# Altium schematic sheet opto.SchDoc: KART : FILTER
size A4; DrawnBy: JNieto; DocumentNumber: 4; Revision: 1.0; SheetNumber: 9; SheetTotal: 10; Version: V 1.0.0
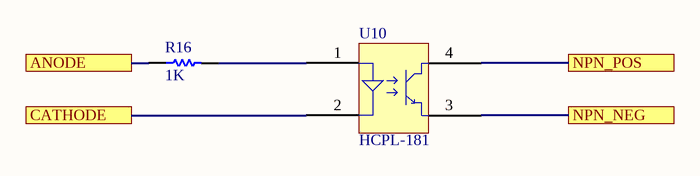
[diagram p0: opto.SchDoc]

## Parts
R16  value 1K  [R0603]
U10  HCPL-181  [SOIC-4]

## Ports
ANODE, CATHODE, NPN_NEG, NPN_POS

## Nets
ANODE: R16.1 ; port ANODE
CATHODE: U10.2 ; port CATHODE
NPN_NEG: U10.3 ; port NPN_NEG
NPN_POS: U10.4 ; port NPN_POS
NetR16_2: R16.2 U10.1

## Library data of the parts
R16 = MCD-00220: Resistor,1K,0603,1%,1/10W; Manufacturer_Part_Number: RC0603FR-0710KL; Manufacturer: YAGEO; Provided_By: Subcon; Initial_Board_Reference: MB1319; Internal_Part_Number: MCD-00220; Status: Released; Part_Type: Resistor; ComponentLink1Description: Datasheet; ECCN_US: n/a; ECCN_EU: n/a; Package: R0603; ComponentLink1URL: http://tunmcdsvn.tun.st.com/Component_Datasheet_Library/Trunk/Resistors/Yageo_Resistor_RC0603-series
U10 = HCPL-181: Optoacoplador